# EAGLE design trickle_charger (EAGLE 8.4.2)
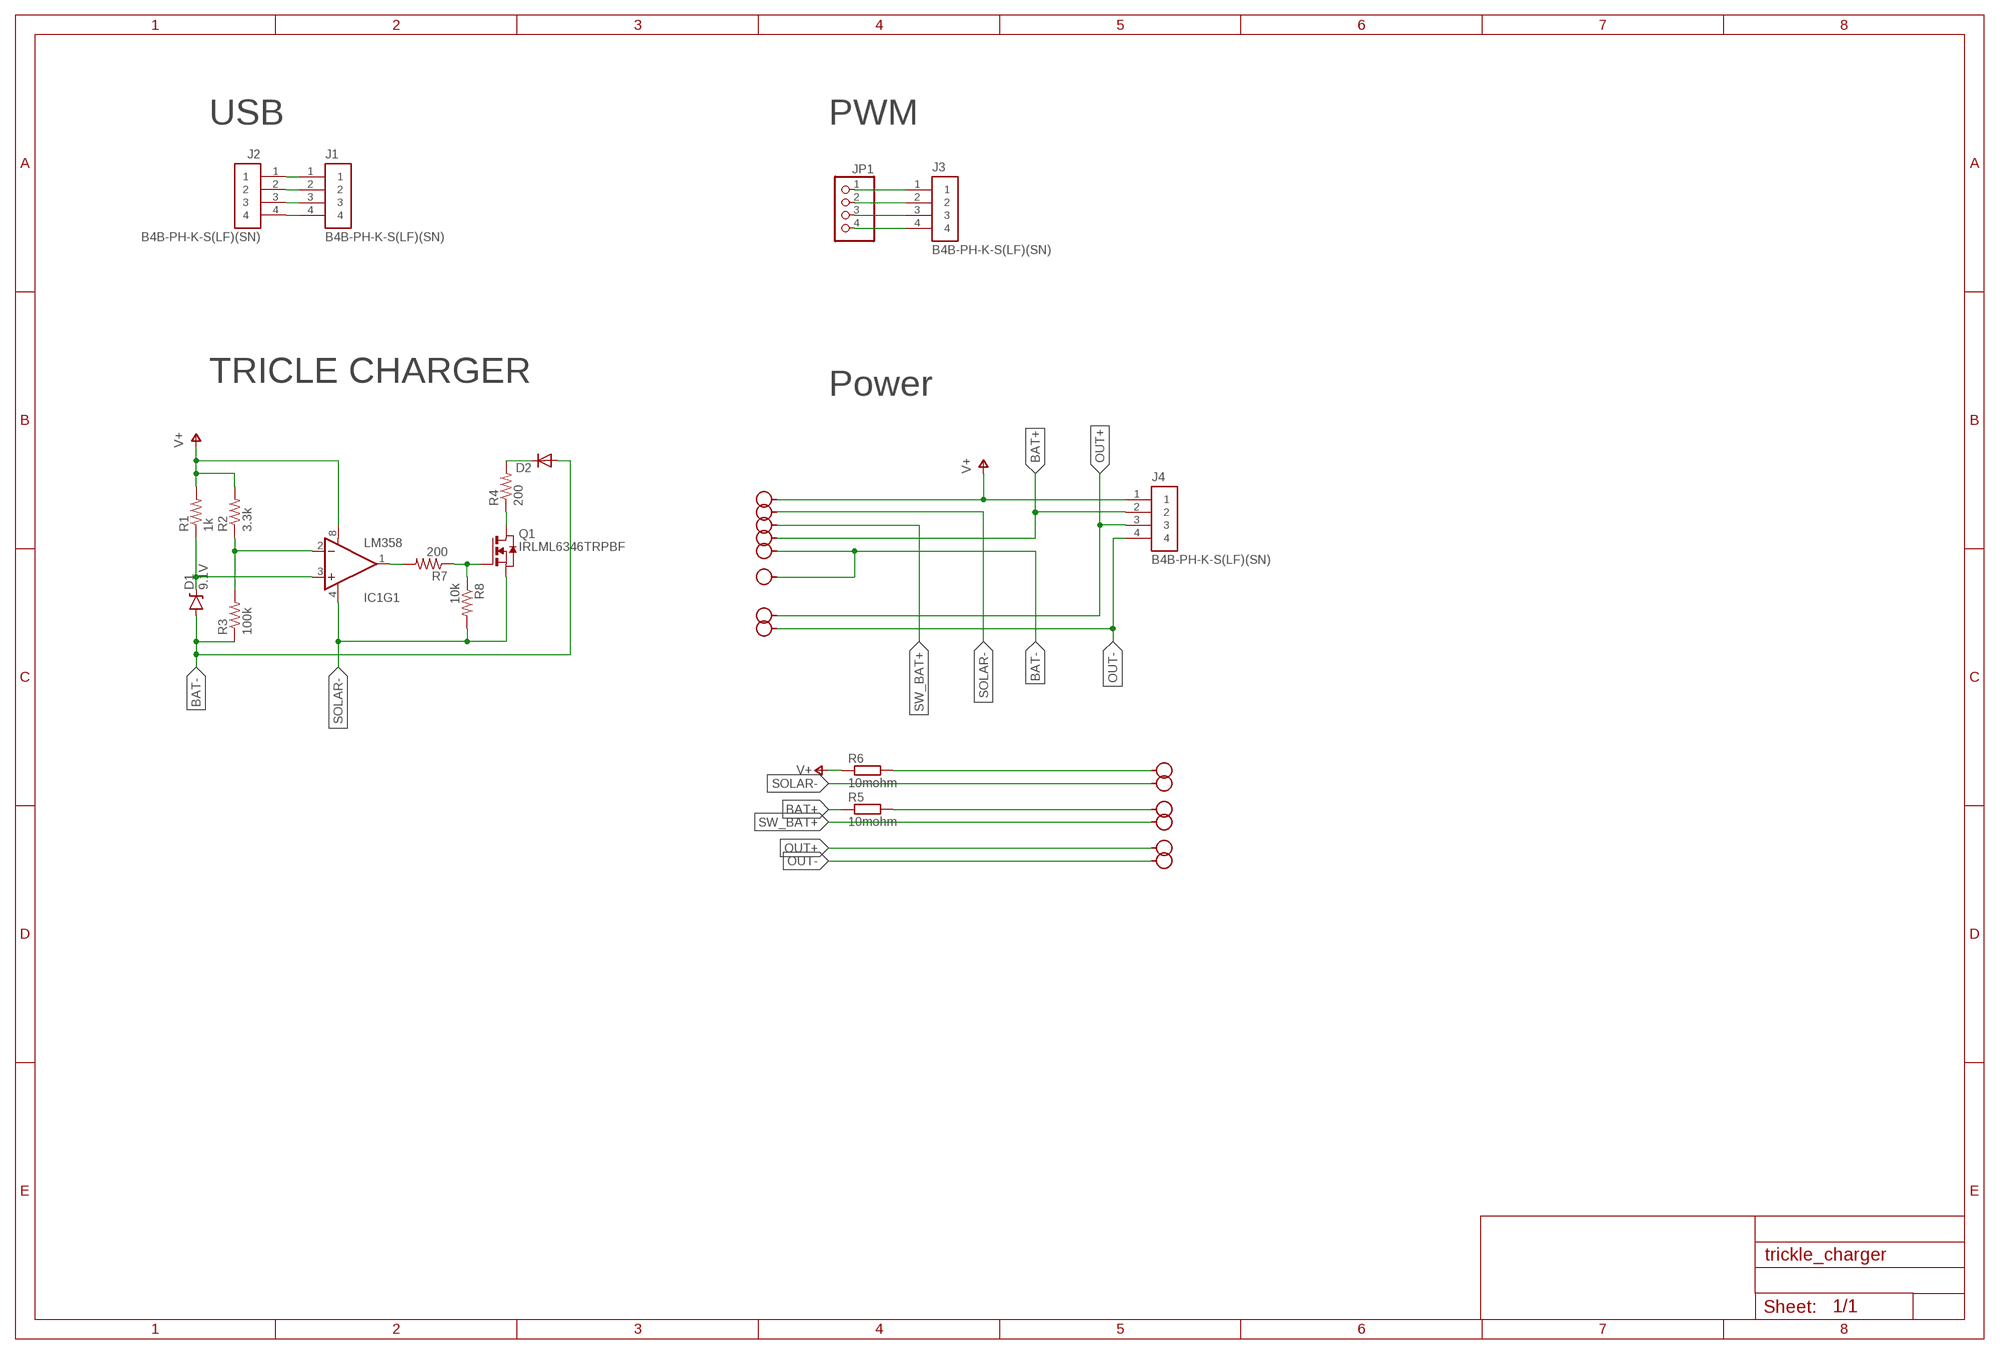
[diagram p0: schematic, sheet 1]

## Parts
D1  9.1V  DIODE-ZENERPTH  [DIODE-ZENER]
D2  DIODE-D-7.5  [D-7.5]
H1  SEW_HOLE-SMALL  [SIMPLE_HOLE_SM]
H2  SEW_HOLE-SMALL  [SIMPLE_HOLE_SM]
H3  SEW_HOLE-SMALL  [SIMPLE_HOLE_SM]
H4  SEW_HOLE-SMALL  [SIMPLE_HOLE_SM]
H5  SEW_HOLE-SMALL  [SIMPLE_HOLE_SM]
H6  SEW_HOLE-SMALL  [SIMPLE_HOLE_SM]
H7  SEW_HOLE-SMALL  [SIMPLE_HOLE_SM]
H8  SEW_HOLE-SMALL  [SIMPLE_HOLE_SM]
H9  SEW_HOLE-SMALL  [SIMPLE_HOLE_SM]
H10  SEW_HOLE-SMALL  [SIMPLE_HOLE_SM]
H11  SEW_HOLE-SMALL  [SIMPLE_HOLE_SM]
H12  SEW_HOLE-SMALL  [SIMPLE_HOLE_SM]
H13  SEW_HOLE-SMALL  [SIMPLE_HOLE_SM]
H14  SEW_HOLE-SMALL  [SIMPLE_HOLE_SM]
IC1  LM358  [DIP08]
J1  B4B-PH-K-S(LF)(SN)  [JST_B4B-PH-K-S(LF)(SN)]
J2  B4B-PH-K-S(LF)(SN)  [JST_B4B-PH-K-S(LF)(SN)]
J3  B4B-PH-K-S(LF)(SN)  [JST_B4B-PH-K-S(LF)(SN)]
J4  B4B-PH-K-S(LF)(SN)  [JST_B4B-PH-K-S(LF)(SN)]
JP1  PINHD-1X4/90  [1X04/90]
Q1  IRLML6346TRPBF  NMOS-FETSOT23  [SOT23]
R1  1k  R-US_R0603  [R0603]
R2  3.3k  R-US_R0603  [R0603]
R3  100k  R-US_R0603  [R0603]
R4  200  R-US_R0603  [R0603]
R5  10mohm  R-EU_R2512  [R2512]
R6  10mohm  R-EU_R2512  [R2512]
R7  200  R-US_R0603  [R0603]
R8  10k  R-US_R0603  [R0603]

## Nets
BAT+: H3.P$1 J4.2 R5.1
BAT-: D1.P$2(A) D2.A H4.P$1 H5.P$1 R3.1
N$1: D1.P$1(C) IC1.3(+IN) R1.1
N$2: D2.C R4.2
N$3: IC1.2(-IN) R2.1 R3.2
N$4: Q1.3(D) R4.1
N$5: IC1.1(OUT) R7.2
N$6: Q1.1(G) R7.1 R8.1
N$9: J3.1 JP1.1
N$10: J3.2 JP1.2
N$11: J3.3 JP1.3
N$12: J3.4 JP1.4
N$13: H9.P$1 R6.2
N$14: H11.P$1 R5.2
OUT+: H7.P$1 H13.P$1 J4.3
OUT-: H8.P$1 H14.P$1 J4.4
SOLAR+: R6.1 ; supply symbol labelled V+
SOLAR-: H2.P$1 H10.P$1 IC1.4(V-) Q1.2(S) R8.2
SW_BAT+: H6.P$1 H12.P$1
USB_D_N: J1.3 J2.3
USB_D_P: J1.2 J2.2
USB_GND: J1.1 J2.1
USB_PWR: J1.4 J2.4
V+: H1.P$1 IC1.8(V+) J4.1 R1.2 R2.2
Unconnected: IC1.5(+IN) IC1.6(-IN) IC1.7(OUT)

## Notes on the sheet
- USB | PWM
- TRICLE CHARGER
- Power

## Library data of the parts
D1 = SparkFun-DiscreteSemi:DIODE-ZENER: Zener Diode Production Part - 8199 3.4V Zener Voltage
D2 = RoboJackets-Diodes:DIODE-: DIODE
H1-H14 = LilyPad-Wearables:SEW_HOLE-SMALL: .070" hole with 20mil annular ring
IC1 = SparkFun-AnalogIC:LM358: Jellybean op-amp; PROD_ID: IC-09172; SPICEPREFIX: X
J1-J4 = B4B-PH-K-S_LF__SN_:B4B-PH-K-S(LF)(SN): PH Series 4 Position 2 mm Pitch Through Hole Crimp Top Entry Shrouded Header; DESCRIPTION: PH Series 4 Position 2 mm Pitch Through Hole Crimp Top Entry Shrouded Header; DIGI-KEY_PART_NUMBER: 455-1706-ND; DIGI-KEY_PURCHASE_URL: https://www.digikey.jp/product-detail/en/jst-sales-america-inc/B4B-PH-K-S_LF__SN_/455-1706-ND/926613?utm_source=snapeda&utm_medium=aggregator&utm_campaign=symbol; MF: JST Sales; MP: B4B-PH-K-S_LF__SN_; PACKAGE: None
JP1 = pinhead+:PINHD-1X4: PIN HEADER
Q1 = openblw:NMOS-FET: Generic NMOS FET
R1-R4 R7 R8 = resistor:R-US_: RESISTOR, American symbol
R5 R6 = resistor:R-EU_: RESISTOR, European symbol

## Board
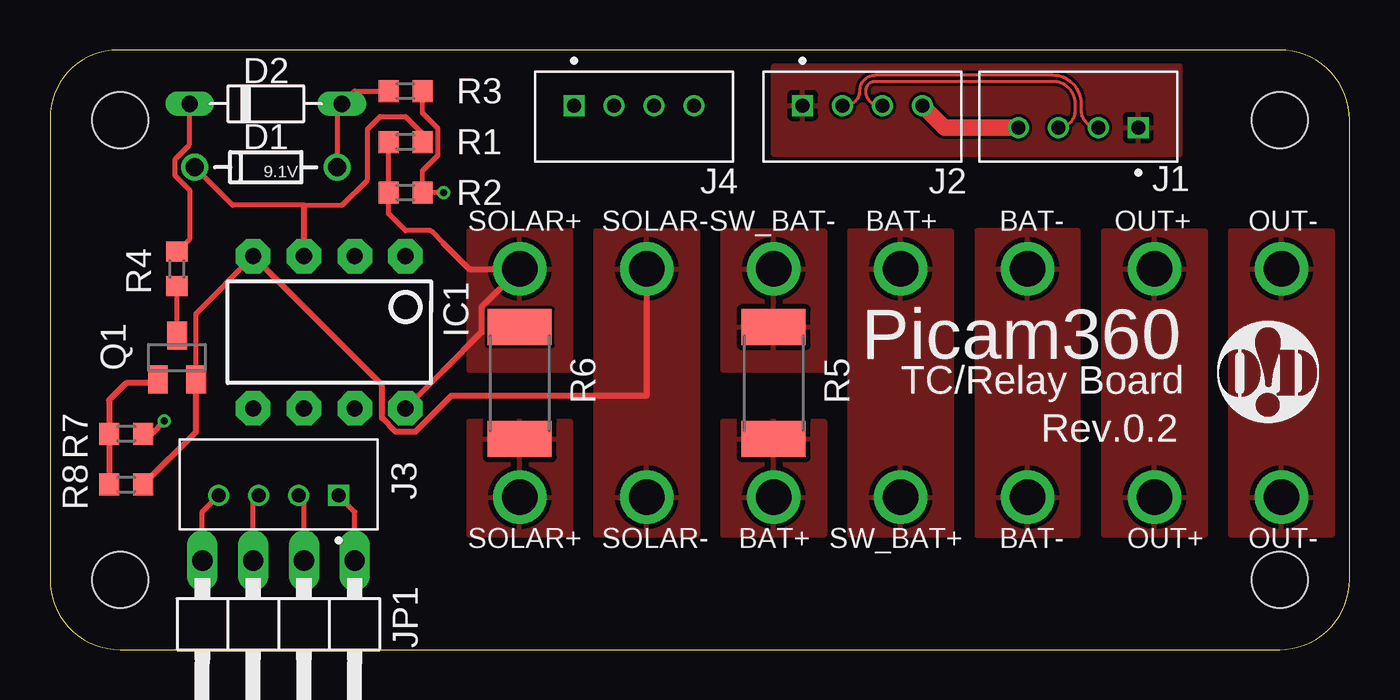
[diagram p1: board, top side]
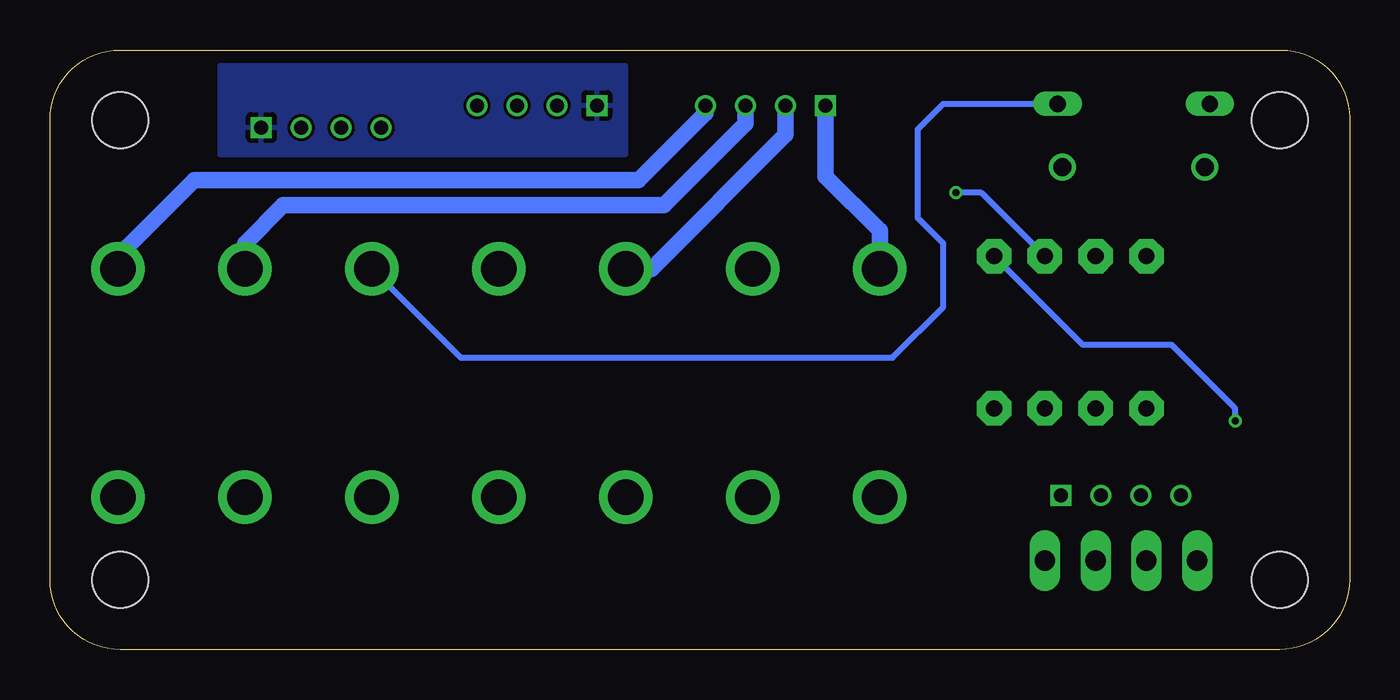
[diagram p2: board, bottom side, seen from below]

Size 65 x 30 mm. Coordinates in mm from the lower left corner, seen from the top.
Outline: 3.5,0 61.5,0 arc90 65,3.5 65,26.5 arc90 61.5,30 3.4,30 arc90 0,26.6 0,3.5 arc90 3.5,0
Copper layers (1*16): Top 0.035mm / dielectric 1.6mm / Bottom 0.035mm
Design rules "Elecrow_2-layer_PCB_eagle_rule": minimum track width 6mil, minimum drill 12mil, track to track 6mil, track to pad 6mil, pad to pad 6mil, via to via 8mil, smd to smd 0mil, copper to edge 20mil, drill to drill 10mil, minimum pad ring 6mil, minimum via ring 6mil, stop-mask expansion 0mil, vias tented up to drill 100mil, thermal gap 10mil
Holes 2.8 mm at 3.5,3.5 61.5,3.5 3.5,26.5 61.5,26.5

### Footprints (pad centres in the part's own frame; a part is rotated, then mirrored left to right if it is on the bottom)
DIODE-ZENER = drill 0.9: P$1 -3.556,0; P$2 3.556,0
D-7.5 = drill 0.813 long: A 3.81,0; C -3.81,0
SIMPLE_HOLE_SM = drill 1.778 pad 2.286: P$1 0,0
DIP08 = drill 0.813 pad 1.727 octagon: 1 -3.81,-3.81; 2 -1.27,-3.81; 3 1.27,-3.81; 4 3.81,-3.81; 5 3.81,3.81; 6 1.27,3.81; 7 -1.27,3.81; 8 -3.81,3.81
JST_B4B-PH-K-S(LF)(SN) = drill 0.7 square: 1 3,-0.55 | drill 0.7: 2 1,-0.55; 3 -1,-0.55; 4 -3,-0.55
1X04/90 = drill 1.016 long: 1 -3.81,-3.81; 2 -1.27,-3.81; 3 1.27,-3.81; 4 3.81,-3.81
SOT23 = smd 1 x 1.4: 1 -0.95,-1.1; 2 0.95,-1.1; 3 0,1.1
R0603 = smd 1 x 1.1: 1 -0.85,0; 2 0.85,0
R2512 = smd 1.8 x 3.2: 1 -2.8,0; 2 2.8,0

### Placement (x,y rotation side)
D1  10.79,24.13 0 top
D2  10.79,27.3 0 top
H1  23.5,19.05 0 top
H2  29.84,19.05 0 top
H3  36.2,19.05 0 top
H4  48.9,7.62 0 top
H5  48.9,19.05 0 top
H6  42.55,7.62 0 top
H7  55.24,19.05 0 top
H8  61.59,19.05 0 top
H9  23.5,7.62 0 top
H10  29.84,7.62 0 top
H11  36.2,7.62 0 top
H12  42.55,19.05 0 top
H13  55.24,7.62 0 top
H14  61.59,7.62 0 top
IC1  13.97,15.88 180 top
J1  51.44,26.67 0 top
J2  40.64,26.67 180 top
J3  11.43,8.26 0 top
J4  29.21,26.67 180 top
JP1  11.43,0.64 180 top
LOGO1  [OHMYDIGIFAB_LOGO]  60.94,13.84 0 top
Q1  6.35,14.61 0 top
R1  17.78,25.4 180 top
R2  17.78,22.86 180 top
R3  17.78,27.94 0 top
R4  6.35,19.05 90 top
R5  36.2,13.34 270 top
R6  23.5,13.34 270 top
R7  3.81,10.79 0 top
R8  3.81,8.26 0 top

### Tracks (layer width: path | path; a pad name or v marks a point on that pad's centre or on a via)
BAT+
  Bottom 0.813: J4.2 28.21,25.77 34.92,19.05 H3.P$1
  pour Top: 33.66,20.95 38.73,20.95 38.73,13.97 33.66,13.97
BAT-
  Top 0.254: D1.P$2 14.35,27.05 D2.A 15.24,27.94 R3.1
  Bottom 0.305: H5.P$1 44.45,14.61 22.86,14.61 20.32,17.14 20.32,20.32 21.59,21.59 21.59,26.04 20.32,27.3 D2.A
  pour Top: 46.35,20.95 46.35,5.71 51.44,5.71 51.44,20.95
N$1
  Top 0.254: D1.P$1 9.14,22.23 12.7,22.23 14.61,22.23 15.88,23.5 15.88,26.04 16.51,26.67 17.78,26.67 18.63,25.82 R1.1
  Top 0.305: IC1.3 12.7,22.23
N$2
  Top 0.254: D2.C 6.99,25.27 6.26,24.54 6.26,23.72 6.99,22.99 6.99,20.54 R4.2
N$3  (via drill 0.35)
  Top 0.254: R3.2 18.63,26.84 19.41,26.07 19.41,24.73 18.63,23.95 R2.1 v19.68,22.86
  Bottom 0.305: IC1.2 18.41,22.86 v19.68,22.86
N$4
  Top 0.254: Q1.3 R4.1
N$5  (via drill 0.35)
  Top 0.305: R7.2 5.08,10.79 v5.71,11.43
  Bottom 0.305: v5.71,11.43 5.71,12.06 8.89,15.24 13.34,15.24 IC1.1
N$6
  Top 0.305: Q1.1 5.23,13.34 3.81,13.34 2.96,12.48 R7.1 R8.1
N$9
  Top 0.254: JP1.1 15.24,6.89 J3.1
N$10
  Top 0.254: JP1.2 12.7,7.43 J3.2
N$11
  Top 0.254: JP1.3 10.16,7.43 J3.3
N$12
  Top 0.254: JP1.4 7.62,6.89 J3.4
N$13
  pour Top: 20.95,11.43 26.04,11.43 26.04,5.71 20.95,5.71
N$14
  pour Top: 33.66,11.43 38.73,11.43 38.73,5.71 33.66,5.71
OUT+
  Bottom 0.813: J4.3 30.21,26.3 34.29,22.23 53.34,22.23 55.24,20.32 H7.P$1
  pour Top: 52.7,20.95 57.78,20.95 57.78,5.71 52.7,5.71
OUT-
  Bottom 0.813: J4.4 32.21,26.84 35.56,23.5 57.78,23.5 61.59,19.68 H8.P$1
  pour Top: 59.05,20.95 64.14,20.95 64.14,5.71 59.05,5.71
SOLAR-
  Top 0.254: Q1.2 7.3,16.82 IC1.4
  Top 0.305: R8.2 7.3,10.89 Q1.2 | H2.P$1 29.84,12.7 20.07,12.7 18.26,10.9 17.3,10.9 16.61,11.58 16.61,13.23 IC1.4
  pour Top: 27.3,20.95 32.38,20.95 32.38,5.71 27.3,5.71
SW_BAT+
  pour Top: 40.01,20.95 45.09,20.95 45.09,5.71 40.01,5.71
USB_D_N
  Top 0.152: J1.3 arc90 51.28,26.97 51.28,27.3 arc90 50.16,28.42 41.27,28.42 arc90 40.79,27.94 arc90 41.51,27.22 J2.3
USB_D_P
  Top 0.152: J1.2 arc-90 51.59,26.97 51.59,27.3 arc90 50.16,28.73 41.27,28.73 arc90 40.49,27.94 arc-90 39.77,27.22 J2.2
USB_GND
  pour Bottom: 36.2,24.77 36.2,29.21 56.52,29.21 56.52,24.77
  pour Top: 36.2,24.77 36.2,29.21 56.52,29.21 56.52,24.77
USB_PWR
  Top 0.813: J2.4 44.74,26.12 J1.4
V+
  Top 0.254: R1.2 R2.2 16.93,21.8 17.78,20.95 19.05,20.95 19.68,20.32 | IC1.8 19.68,13.97
  Top 0.305: 19.68,13.97 21.59,15.88 21.59,17.16 21.77,17.34 21.79,17.34 H1.P$1 20.95,19.05 19.68,20.32
  Bottom 0.813: J4.1 26.21,23.67 23.5,20.95 H1.P$1
  pour Top: 20.95,20.95 26.04,20.95 26.04,13.97 20.95,13.97

### Text on the board
tPlace: SOLAR+ | SOLAR- | SW_BAT- | BAT+ | BAT- | OUT+ | OUT- | Picam360 | TC/Relay Board | Rev.0.2 | SOLAR+ | SOLAR- | BAT+ | SW_BAT+ | BAT- | OUT+ | OUT-